# Altium project 175-00003, rev2, Sinistro ASP.PrjPCB
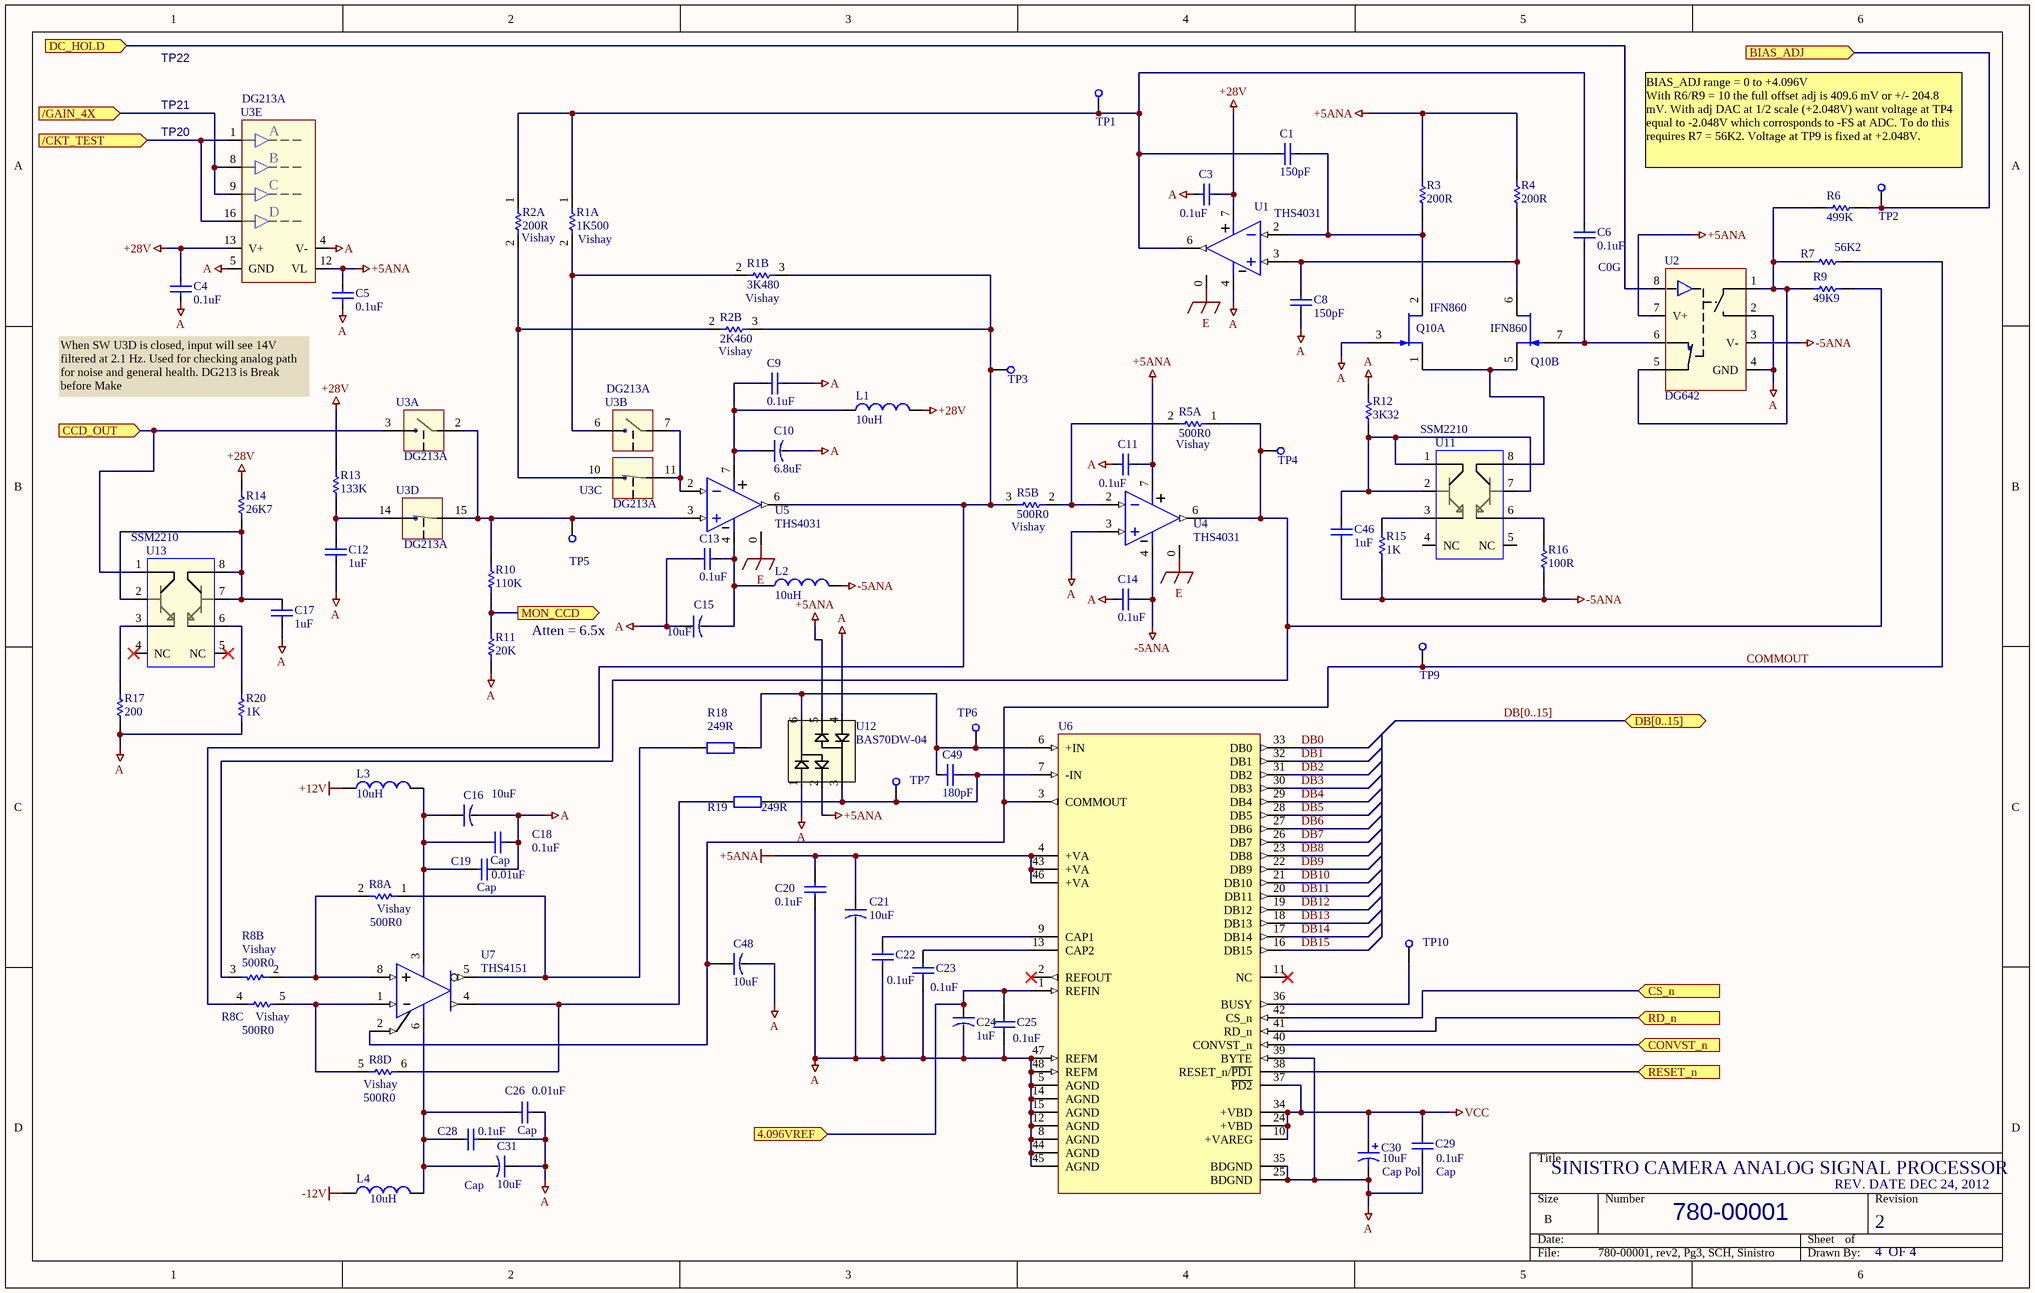
[diagram p0: 780-00001, rev2, Pg3, SCH, Sinistro ASP.SchDoc]
1 sheet, 75 parts. Net scope: flat (ports and power ports of the same name join across sheets).
Board file: 175-00003, rev 2, Sinistro ASP.PcbDoc

## Sheet 780-00001, rev2, Pg3, SCH, Sinistro ASP.SchDoc
size B; PageSetup: Record=PageOptions|CenterHorizontal=True|CenterVertical=True|PrintScale=1.09|XCorrection=1.00|YCorrection=1.00|PrintKind=0|BorderSize=5000000|LeftOffset=0|BottomOffset=0|Orientation=2|PaperLength=1000|PaperWidth=1000|Scale=100|PaperSource=7|PrintQuality=-4|MediaType=1|DitherType=10|PaperKind=Tabloid 11 x 17in|PrintScaleMode=1

### Parts
C1  value 150pF  [SMD_0805]  (hidden comment: Cap SMD)
C3  value 0.1uF  [SMD_0805]  (hidden comment: Cap)
C4  value 0.1uF  [SMD_0805]  (hidden comment: Cap)
C5  value 0.1uF  [SMD_0805]  (hidden comment: Cap)
C6  C0G  value 0.1uF  [1812]
C8  value 150pF  [SMD_0805]  (hidden comment: Cap SMD)
C9  value 0.1uF  [SMD_0805]  (hidden comment: Cap)
C10  value 6.8uF  [SMD_CAP_6032]  (hidden comment: 35V)
C11  value 0.1uF  [SMD_0805]  (hidden comment: Cap)
C12  value 1uF  [SMD_0805]  (hidden comment: Cap SMD)
C13  value 0.1uF  [SMD_0805]  (hidden comment: Cap)
C14  value 0.1uF  [SMD_0805]  (hidden comment: Cap)
C15  value 10uF  [SMD_CAP_3216]  (hidden comment: Cap Pol)
C16  value 10uF  [SMD_CAP_3216]  (hidden comment: Cap Pol)
C17  value 1uF  [SMD_0805]  (hidden comment: Cap SMD)
C18  Cap  value 0.1uF  [SMD_0805]
C19  Cap  value 0.01uF  [SMD_0805]
C20  value 0.1uF  [SMD_0805]  (hidden comment: Cap)
C21  value 10uF  [SMD_CAP_3216]  (hidden comment: Cap Pol)
C22  value 0.1uF  [SMD_0805]  (hidden comment: Cap)
C23  value 0.1uF  [SMD_0805]  (hidden comment: Cap)
C24  value 1uF  [SMD_CAP_3216]  (hidden comment: Cap Pol)
C25  value 0.1uF  [SMD_0805]  (hidden comment: Cap)
C26  Cap  value 0.01uF  [SMD_0805]
C28  Cap  value 0.1uF  [SMD_0805]
C29  Cap  value 0.1uF  [SMD_0805]
C30  Cap Pol  value 10uF  [SMD_CAP_3216]
C31  value 10uF  [SMD_CAP_3216]  (hidden comment: Cap Pol)
C46  value 1uF  [SMD_0805]  (hidden comment: Cap)
C48  value 10uF  [SMD_CAP_3216]  (hidden comment: Cap Pol)
C49  value 180pF  [SMD_0805]  (hidden comment: Cap SMD)
L1  value 10uH  [SMD_1210_INDUCT]  (hidden comment: Inductor)
L2  value 10uH  [SMD_1210_INDUCT]  (hidden comment: Inductor)
L3  value 10uH  [SMD_1210_INDUCT]  (hidden comment: Inductor)
L4  value 10uH  [SMD_1210_INDUCT]  (hidden comment: Inductor)
Q10  IFN860  [TO-71]  (parts A,B of 2)
R1  Vishay  value 1K500  [vishay 3 pin]  (parts A,B of 2)
R2  Vishay  value 200R  [Vishay 3 pin]  (parts A,B of 2)
R3  value 200R  [SMD_0805]  (hidden comment: Res SMD)
R4  value 200R  [SMD_0805]  (hidden comment: Res SMD)
R5  Vishay  value 500R0  [vishay 3 pin]  (parts A,B of 2)
R6  value 499K  [SMD_0805]  (hidden comment: Res SMD)
R7  value 56K2  [SMD_0805]  (hidden comment: Res SMD)
R8  Vishay  value 500R0  [VISHAY 6 pin]  (parts A,B,C,D of 4)
R9  value 49K9  [SMD_0805]  (hidden comment: Res SMD)
R10  value 110K  [SMD_0805]  (hidden comment: Res SMD)
R11  value 20K  [SMD_0805]  (hidden comment: Res SMD)
R12  value 3K32  [SMD_0805]  (hidden comment: Res SMD)
R13  value 133K  [SMD_0805]  (hidden comment: Res SMD)
R14  value 26K7  [SMD_0805]  (hidden comment: Res SMD)
R15  value 1K  [SMD_0805]  (hidden comment: Res SMD)
R16  value 100R  [SMD_0805]  (hidden comment: Res SMD)
R17  value 200  [SMD_0805]  (hidden comment: Res SMD)
R18  value 249R  [SMD_0805]  (hidden comment: Res SMD)
R19  value 249R  [SMD_0805]  (hidden comment: Res SMD)
R20  value 1K  [SMD_0805]  (hidden comment: Res SMD)
TP1  Test point  [PAD_80D_052H]  (value not drawn)
TP2  Test point  [PAD_80D_052H]  (value not drawn)
TP3  Test point  [PAD_80D_052H]  (value not drawn)
TP4  Test point  [PAD_80D_052H]  (value not drawn)
TP5  Test point  [PAD_80D_052H]  (value not drawn)
TP6  Test point  [PAD_80D_052H]  (value not drawn)
TP7  Test point  [PAD_80D_052H]  (value not drawn)
TP9  Test point  [PAD_80D_052H]  (value not drawn)
TP10  Test point  [PAD_80D_052H]  (value not drawn)
U1  THS4031  [MSOP with PowerPAD]
U2  DG642  [182H_M]
U3  DG213A  [SOIC16]  (parts A,B,C,D,E of 5)
U4  THS4031  [MSOP with PowerPAD]
U5  THS4031  [MSOP with PowerPAD]
U6  0.2 ppm  [TQFP48_m]  (value not drawn)
U7  THS4151  [182H_M]
U11  SSM2210  [SO-8_M]
U12  value BAS70DW-04  [SOT-363]  (hidden comment: Diode array)
U13  SSM2210  [SO-8_M]

### Ports
4.096VREF (in), /CKT_TEST (in), /GAIN_4X (in), BIAS_ADJ (in), CCD_OUT (in), CONVST_n (in), CS_n (in), DB[0..15] (bidir), DC_HOLD (in), MON_CCD (out), RD_n (in), RESET_n (in)

### Nets
+5ANA: C5.2 C11.2 C20.2 C21.1 R3.1 R4.1 U2.7(V+) U3.12(VL) U4.7(V+) U6.4(+VA) U6.43(+VA) U6.46(+VA) U12.2(C1) U12.5(C2)
+12V: L3.1
+28V: C3.2 C4.2 L1.2 R13.2 R14.2 U1.7(V+) U3.13(V+)
-5ANA: C14.2 C46.1 L2.2 R15.2 R16.2 U2.3(V-) U4.4(V-)
-12V: L4.1
A: C3.1 C4.1 C5.1 C8.1 C9.2 C10.neg C11.1 C12.1 C13.1 C14.1 C15.1 C16.2 C17.1 C18.2 C19.2 C20.1 C21.2 C22.1 C23.1 C24.2 C25.1 C26.2 C28.2 C29.1 C30.2 C31.1 C48.2 Q10.3(G) R11.1 R12.1 R17.1 R20.1 U1.4(V-) U2.2(D1) U2.4(GND) U3.4(V-) U3.5(GND) U4.3(IN+) U6.5(AGND) U6.8(AGND) U6.12(AGND) U6.14(AGND) U6.15(AGND) U6.25(BDGND) U6.35(BDGND) U6.39(BYTE) U6.44(AGND) U6.45(AGND) U6.47(REFM) U6.48(REFM) U12.1(A1) U12.4(A2)
E: U1.0(PowerPAD) U4.0(PowerPAD) U5.0(PowerPAD)
VCC: C29.2 C30.1 U6.10(+VAREG) U6.24(+VBD) U6.34(+VBD) U6.37(~{PD2})
COMMOUT: C48.1 R7.2 TP9.1(TP) U6.3(COMMOUT) U7.2(VOCM)
DB0: U6.33(DB0)
DB1: U6.32(DB1)
DB2: U6.31(DB2)
DB3: U6.30(DB3)
DB4: U6.29(DB4)
DB5: U6.28(DB5)
DB6: U6.27(DB6)
DB7: U6.26(DB7)
DB8: U6.23(DB8)
DB9: U6.22(DB9)
DB10: U6.21(DB10)
DB11: U6.20(DB11)
DB12: U6.19(DB12)
DB13: U6.18(DB13)
DB14: U6.17(DB14)
DB15: U6.16(DB15)
NetC1_1: C1.1 C6.2 R1.1 R2.1 TP1.1(TP) U1.6(OUT)
NetC1_2: C1.2 Q10.2(D) R3.2 U1.2(IN-)
NetC6_1: C6.1 Q10.7(G) U2.6(D2)
NetC8_2: C8.2 Q10.6(D) R4.2 U1.3(IN+)
NetC9_1: C9.1 C10.pos L1.1 U5.7(V+)
NetC12_2: C12.2 R13.1 U3.14(S4)
NetC13_2: C13.2 C15.2 L2.1 U5.4(V-)
NetC16_1: C16.1 C18.1 C19.1 L3.2 U7.3(V+)
NetC17_2: C17.2 R14.1 U13.2(B1) U13.7(B2) U13.8(C2)
NetC22_2: C22.2 U6.9(CAP1)
NetC23_2: C23.2 U6.13(CAP2)
NetC24_1: C24.1 C25.2 U6.1(REFIN) ; port 4.096VREF
NetC26_1: C26.1 C28.1 C31.2 L4.2 U7.6(V-)
NetC46_2: C46.2 R12.2 U11.1(C1) U11.2(B1) U11.7(B2)
NetC49_1: C49.1 R18.2 TP6.1(TP) U6.6(+IN) U12.6(AC1)
NetC49_2: C49.2 R19.2 TP7.1(TP) U6.7(-IN) U12.3(AC2)
NetQ10_1: Q10.1(S) Q10.5(S) U11.8(C2)
NetR1_2: R1.2 U3.6(D2)
NetR1_3: R1.3 R2.3 R5.3 R8.4 TP3.1(TP) U5.6(OUT)
NetR2_2: R2.2 U3.10(S3)
NetR5_1: R5.1 R8.3 R9.2 TP4.1(TP) U4.6(OUT)
NetR5_2: R5.2 U4.2(IN-)
NetR6_1: R6.1 R7.1 R9.1 U2.1(S1) U2.5(S2)
NetR6_2: R6.2 TP2.1(TP) ; port BIAS_ADJ
NetR8_1: R8.1 R18.1 U7.5(-OUT)
NetR8_2: R8.2 U7.8(+IN)
NetR8_5: R8.5 U7.1(-IN)
NetR8_6: R8.6 R19.1 U7.4(+OUT)
NetR10_1: R10.1 R11.2 ; port MON_CCD
NetR10_2: R10.2 TP5.1(TP) U3.2(D1) U3.15(D4) U5.3(IN+)
NetR15_1: R15.1 U11.3(E1)
NetR16_1: R16.1 U11.6(E2)
NetR17_2: R17.2 U13.3(E1)
NetR20_2: R20.2 U13.6(E2)
NetTP10_1: TP10.1(TP) U6.36(BUSY)
NetU2_8: U2.8(IN) ; port DC_HOLD
NetU3_1: U3.1(IN1) U3.16(IN1) ; port /CKT_TEST
NetU3_3: U3.3(S1) U13.1(C1) ; port CCD_OUT
NetU3_7: U3.7(S2) U3.11(D3) U5.2(IN-)
NetU3_8: U3.8(IN1) U3.9(IN1) ; port /GAIN_4X
NetU6_38: U6.38(RESET_n/~{PD1}) ; port RESET_n
NetU6_40: U6.40(CONVST_n) ; port CONVST_n
NetU6_41: U6.41(RD_n) ; port RD_n
NetU6_42: U6.42(CS_n) ; port CS_n

Not connected (* = marked no-connect by the designer): U1 1(LOGIC_REF) 8(/DISABLE); U4 1(LOGIC_REF) 8(/DISABLE); U5 1(LOGIC_REF) 8(/DISABLE); U6 2(REFOUT)* 11(NC)*; U7 7(NC); U11 4(NC) 5(NC); U13 4(NC)* 5(NC)*

### Buses and harness runs
bus DB[0..15] = port DB[0..15]

### Notes on the sheet
- TP22
- TP21
- TP20
- (near TP2) BIAS_ADJ range = 0 to +4.096V
  With R6/R9 = 10 the full offset adj is 409.6 mV or +/- 204.8 mV. With adj DAC at 1/2 scale (+2.048V) want voltage at TP4 equal to -2.048V which corrosponds to -FS at ADC. To do this requires R7 = 56K2. Voltage at TP9 is fixed at +2.048V.
- When SW U3D is closed, input will see 14V filtered at 2.1 Hz. Used for checking analog path for noise and general health. DG213 is Break before Make
- Atten = 6.5x
- SINISTRO CAMERA ANALOG SIGNAL PROCESSOR
- 780-00001
- REV. DATE DEC 24, 2012
- 2
- 4
- OF 4
- (in symbol DG213A, part E) A; B; C; D

### Library data of the parts
C1 C8 = Cap SMD: Capacitor; Manufacturer: AVX; Manuf p/n: 08055A151JAT2A; Vendor: DigiKey; Vendor p/n: 478-1318-1-ND; Vendor Mult.: 10; LCO p/n: 120-00031; COST: 0.11
C3-C5 C9 C11 C13 C14 = Cap SMD: Capacitor; Manufacturer: AVX; Manuf p/n: 08055C104KAT2A; Vendor: DigiKey; Vendor p/n: 478-1395-1-ND; Vendor Mult.: 10; LCO p/n: 120-00002; COST: 0.088
C6 = Cap SMD: Capacitor; Manufacturer: TDK; Manuf p/n: C4532C0G1H104J; Vendor: DigiKey; Vendor p/n: 445-2707-1-ND; Vendor Mult.: 1; LCO p/n: 120-00029; COST: 4.12
C10 = Cap Tant 35V: outline 6.0mm x 3.2mm; Manufacturer: Nichicon; Manuf p/n: F911V685MCC; Vendor: DigiKey; Vendor p/n: 493-2325-1-ND; Vendor Mult.: 1; LCO p/n: 120-00010; COST: 1.55
C12 C17 C46 = Cap SMD: Capacitor; Manufacturer: MURATA; Manuf p/n: GRM21BR71H105KA12L; Vendor: DigiKey; Vendor p/n: 490-4736-1-ND; Vendor Mult.: 1; LCO p/n: 120-00006; COST: 0.48
C15 C16 C21 C31 C48 = Cap Tant 15V: outline 3.2mm x 1.6mm; Manufacturer: KEMET; Manuf p/n: T494A106M016AT; Vendor: DigiKey; Vendor p/n: 399-3824-1-ND; Vendor Mult.: 1; LCO p/n: 120-00001; COST: 0.78
C18 C20 C22 C23 C25 C28 C29 = Cap: Capacitor; Manufacturer: AVX; Manuf p/n: 08055C104KAT2A; Vendor: DigiKey; Vendor p/n: 478-1395-1-ND; Vendor Mult.: 10; LCO p/n: 120-00002; COST: 0.088
C19 C26 = Cap: Capacitor; Manufacturer: MURATA; Manuf p/n: GRM2195C1H103JA01D; Vendor: DigiKey; Vendor p/n: 490-1642-1-ND; Vendor Mult.: 1; LCO p/n: 120-00016; COST: 0.45
C24 = Cap Tant 15V: outline 3.2mm x 1.6mm; Manufacturer: MURATA; Manuf p/n: GRM21BR71H105KA12L; Vendor: DigiKey; Vendor p/n: 490-4736-1-ND; Vendor Mult.: 1; LCO p/n: 120-00006; COST: 0.48
C30 = Cap Pol1: Manufacturer: KEMET; Manuf p/n: T494A106M016AT; Vendor: DigiKey; Vendor p/n: 399-3824-1-ND; Vendor Mult.: 1; LCO p/n: 120-00001; COST: 0.78
C49 = Cap SMD: Capacitor; Manufacturer: AVX; Manuf p/n: 08055A181JAT2A; Vendor: DigiKey; Vendor p/n: 478-1319-2-ND; Vendor Mult.: 10; LCO p/n: 120-00063; COST: 0.22
L1-L4 = Inductor: Manufacturer: MURATA; Manuf p/n: LQH32MN100J23L; Vendor: DigiKey; Vendor p/n: 490-2505-1-ND; Vendor Mult.: 1; LCO p/n: 155-00010; COST: 0.39
Q10 = IFN860: N-JFET NJ450L Process; Manufacturer: INTERFET; Vendor Mult.: 1; LCO p/n: 195-00005; Manuf p/n: IFN860; Vendor: INTERFET; Vendor p/n: IFN860; COST: 12.18; VALUE: IFN860
R1 = Res Match Pair: Manuf p/n: 300144  Series 1K500/3K480; Vendor Mult.: 1; LCO p/n: 180-00082; Manufacturer: Vishay; Vendor: Vishay; COST: 24.12
R2 = Res Match Pair: Manuf p/n: 300144 Series 200R0/2K460; Vendor Mult.: 1; LCO p/n: 180-00081; Manufacturer: Vishay; Vendor: Vishay; COST: 24.12
R3 R4 = Res SMD: Resistor; Manufacturer: Vishay; Manuf p/n: CRCW0805200RFNEA; Vendor: DigiKey; Vendor p/n: 541-200CCT-ND; Vendor Mult.: 10; LCO p/n: 181-02000; COST: 0.09
R5 = Res Match Pair: Manuf p/n: 300144 Series  500R0/500R0; Vendor Mult.: 1; LCO p/n: 180-00080; Manufacturer: Vishay; Vendor: Vishay; COST: 24.12
R6 = Res SMD: Resistor; Manufacturer: Vishay; Manuf p/n: CRCW0805499KFNEA; Vendor: DigiKey; Vendor p/n: 541-499KCCT-ND; Vendor Mult.: 10; LCO p/n: 181-04993; COST: 0.09
R7 = Res SMD: Resistor; Manufacturer: Vishay; Manuf p/n: CRCW080539K2FNEA; Vendor: DigiKey; Vendor p/n: 541-39.2KCCT-ND; Vendor Mult.: 10; LCO p/n: 181-05622; COST: 0.09
R8 = Res Matched Quad: TCR matched; Manuf p/n: 300145 Series; Vendor Mult.: 1; LCO p/n: 180-00083; Manufacturer: Vishay; Vendor: Vishay; COST: 42.47
R9 = Res SMD: Resistor; Manufacturer: Vishay; Manuf p/n: CRCW080549K9FNEA; Vendor: DigiKey; Vendor p/n: 541-49.9KCCT-ND; Vendor Mult.: 10; LCO p/n: 181-04992; COST: 0.09
R10 = Res SMD: Resistor; Manufacturer: Vishay; Manuf p/n: CRCW0805100KFNEA; Vendor: DigiKey; Vendor p/n: 541-100KCCT-ND; Vendor Mult.: 10; LCO p/n: 181-01103; COST: 0.09
R11 = Res SMD: Resistor; Manufacturer: Vishay; Manuf p/n: CRCW080520K0FNEA; Vendor: DigiKey; Vendor p/n: 541-20.0KCCT-ND; Vendor Mult.: 10; LCO p/n: 181-02002; COST: 0.09
R12 = Res SMD: Resistor; Manufacturer: Vishay; Manuf p/n: CRCW08053K32FNEA; Vendor: DigiKey; Vendor p/n: 541-3.32KCCT-ND; Vendor Mult.: 10; LCO p/n: 181-03321; COST: 0.09
R13 = Res SMD: Resistor; Manufacturer: Vishay; Manuf p/n: CRCW0805100KFNEA; Vendor: DigiKey; Vendor p/n: 541-100KCCT-ND; Vendor Mult.: 10; LCO p/n: 181-01333; COST: 0.09
R14 = Res SMD: Resistor; Manufacturer: Vishay; Manuf p/n: CRCW080526K7FNEA; Vendor: DigiKey; Vendor p/n: 541-26.7KCCT-ND; Vendor Mult.: 10; LCO p/n: 180-00053; COST: 0.09
R15 R20 = Res SMD: Resistor; Manufacturer: Vishay; Manuf p/n: CRCW08051K00FNEA; Vendor: DigiKey; Vendor p/n: 541-1.00KCCT-ND; Vendor Mult.: 10; LCO p/n: 181-01001; COST: 0.09
R16 = Res SMD: Resistor; Manufacturer: Vishay; Manuf p/n: CRCW0805100RFNEA; Vendor: DigiKey; Vendor p/n: 541-100CCT-ND; Vendor Mult.: 10; LCO p/n: 181-01000; COST: 0.09
R17 = Res SMD: Resistor; Manufacturer: Vishay; Manuf p/n: CRCW08051K00FNEA; Vendor: DigiKey; Vendor p/n: 541-1.00KCCT-ND; Vendor Mult.: 10; LCO p/n: 181-02000; COST: 0.09
R18 R19 = Res2: Resistor; Manufacturer: Vishay; Manuf p/n: CRCW0805249RFNEA; Vendor: DigiKey; Vendor p/n: 541-249CCT-ND; Vendor Mult.: 10; LCO p/n: 181-02490; COST: 0.09
TP1-TP7 TP9 TP10 = Test point: Manufacturer: Keystone; Manuf p/n: 1249; Vendor: Bisco Ind.; Vendor Mult.: 10; LCO p/n: 125-00013; Vendor p/n: 1249; COST: 0.18; VALUE: Test point
U1 U4 U5 = THS4031: Low Noise, High Speed Amplifier; Manufacturer: TEXAS INST; Manuf p/n: THS4031IDGNR; Vendor: DigiKey; Vendor p/n: 296-10030-1-ND; Vendor Mult.: 1; LCO p/n: 150-00063; COST: 4.39; Value: THS4031
U2 = DG642: Manufacturer: VISHAY; Manuf p/n: DG642DY-E3; Vendor: Newark; Vendor p/n: 49K9688; Vendor Mult.: 1; LCO p/n: 150-00029; COST: 2.00; Value: DG642
U3 = DG213A: DG213 QUAD NO/NC; Manufacturer: VISHAY; Manuf p/n: DG213DY-T1-E3; Vendor: DIGIKEY; Vendor p/n: DG213DY-T1-E3CT-ND; Vendor Mult.: 1; LCO p/n: 150-00028; COST: 2.73; VALUE: DG213A
U6 = ADS8422: AD8422; Manufacturer: TEXAS INST; Manuf p/n: ADS8422IBPFBT; Vendor: Mouser; Vendor p/n: 595-ADS8422IBPFBT; Vendor Mult.: 1; LCO p/n: 150-00023; COST: 49.42; Value: ADS8422
U7 = THS4151: DIFF AMP; Manufacturer: TEXAS INST; Manuf p/n: THS4151CD; Vendor: Mouser; Vendor p/n: 595-THS4151CD; Vendor Mult.: 1; LCO p/n: 150-00064; COST: 10.30; Value: THS4151
U11 U13 = SSM2210: Dual Matched NPN; Manufacturer: ANALOG DEVICES; Manuf p/n: SSM2210SZ; Vendor: DIGIKEY; Vendor p/n: SSM2210SZ-ND; Vendor Mult.: 1; LCO p/n: 150-00062; COST: 5.40; VALUE: SSM2210
U12 = Diode array: Dual series array; Manufacturer: DIODES INC; Manuf p/n: BAS70DW-04-7-F; Vendor: DIGIKEY; Vendor p/n: BAS70DW-04-FDICT-ND; Vendor Mult.: 1; LCO p/n: 150-00025; COST: 0.67